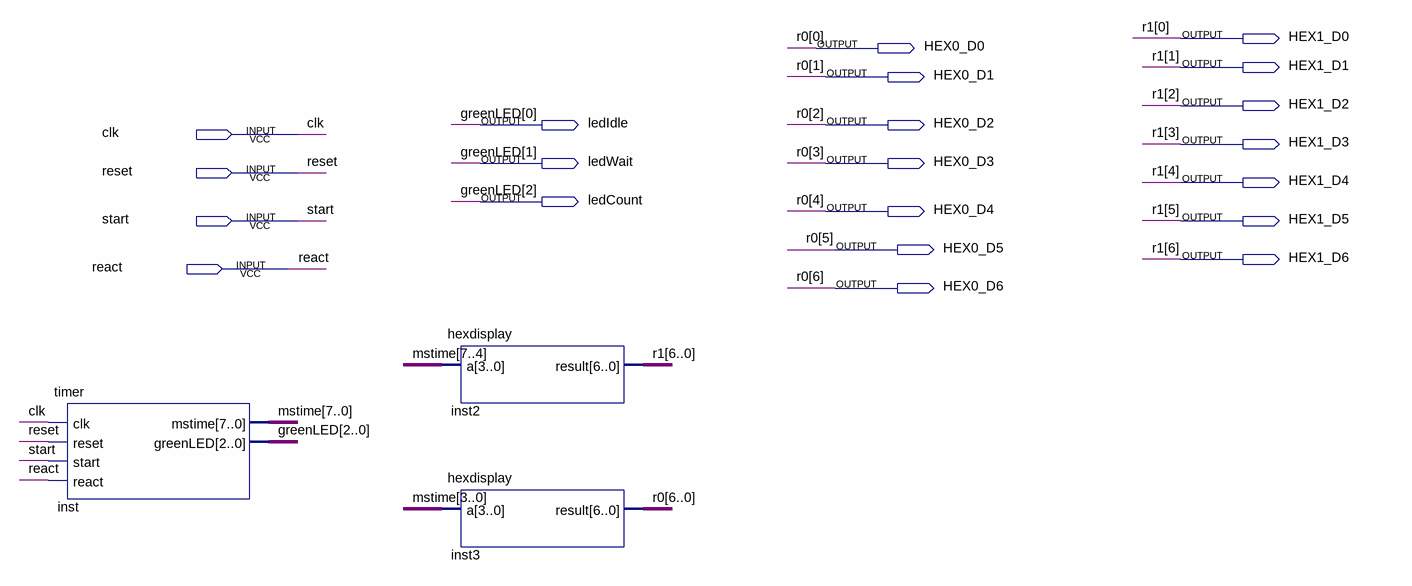
[diagram p0: schematic sheet]
// Quartus schematic reaction.bdf as structural Verilog: 3 symbols, 21 pins
module reaction (
  input  clk,
  input  reset,
  input  start,
  input  react,
  output HEX1_D0,
  output HEX0_D0,
  output HEX1_D1,
  output HEX0_D1,
  output HEX1_D2,
  output ledIdle,
  output HEX0_D2,
  output HEX1_D3,
  output ledWait,
  output HEX0_D3,
  output HEX1_D4,
  output ledCount,
  output HEX0_D4,
  output HEX1_D5,
  output HEX0_D5,
  output HEX1_D6,
  output HEX0_D6
);

  wire [7:0] mstime;

  timer inst (
    .clk(clk), .reset(reset), .start(start), .react(react), .mstime(mstime),
    .greenLED({ledCount, ledWait, ledIdle}));
  hexdisplay inst2 (.a(mstime[7:4]), .result({HEX1_D6, HEX1_D5, HEX1_D4, HEX1_D3, HEX1_D2, HEX1_D1, HEX1_D0}));
  hexdisplay inst3 (.a(mstime[3:0]), .result({HEX0_D6, HEX0_D5, HEX0_D4, HEX0_D3, HEX0_D2, HEX0_D1, HEX0_D0}));

  // Other names for the same wires on the sheet: greenLED[2:0] = {ledCount, ledWait, ledIdle};
  //   r0[6:0] = {HEX0_D6, HEX0_D5, HEX0_D4, HEX0_D3, HEX0_D2, HEX0_D1, HEX0_D0};
  //   r1[6:0] = {HEX1_D6, HEX1_D5, HEX1_D4, HEX1_D3, HEX1_D2, HEX1_D1, HEX1_D0}
endmodule
